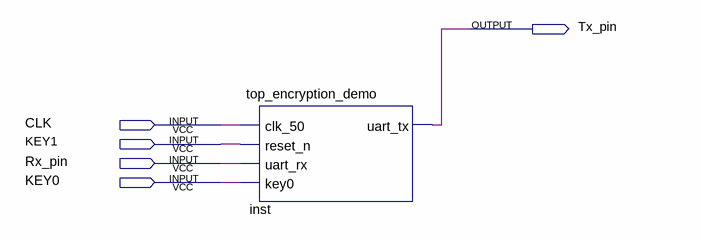
[diagram p0: schematic sheet]
// Quartus schematic FinalProject.bdf as structural Verilog: 1 symbols, 5 pins
module FinalProject (
  input  CLK,
  input  KEY1,
  input  Rx_pin,
  input  KEY0,
  output Tx_pin
);

  top_encryption_demo inst (.clk_50(CLK), .reset_n(KEY1), .uart_rx(Rx_pin), .key0(KEY0), .uart_tx(Tx_pin));
endmodule
